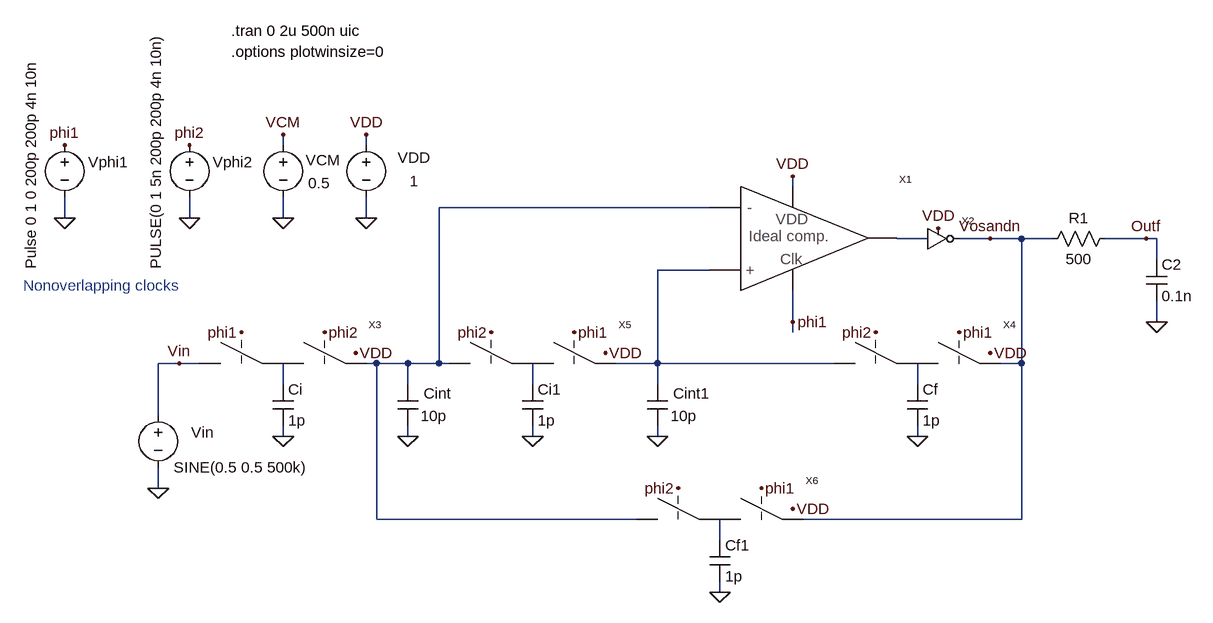
[diagram p0: schematic _Fig6_21_2nd_MSD.asc]
_Fig6_21_2nd_MSD.asc, the LTspice schematic file:
Version 4
SHEET 1 1008 680
WIRE -400 -176 -400 -192
WIRE -272 -176 -272 -192
WIRE 384 -112 384 -128
WIRE 256 -80 -160 -80
WIRE -736 -64 -736 -96
WIRE -544 -64 -544 -96
WIRE -400 -64 -400 -96
WIRE -272 -64 -272 -96
WIRE 592 -32 544 -32
WIRE 688 -32 640 -32
WIRE 736 -32 688 -32
WIRE 784 -32 736 -32
WIRE 928 -32 864 -32
WIRE 944 -32 928 -32
WIRE 944 0 944 -32
WIRE 256 16 176 16
WIRE 384 96 384 48
WIRE 944 96 944 64
WIRE 384 112 384 96
WIRE -560 160 -592 160
WIRE -528 160 -560 160
WIRE -256 160 -272 160
WIRE -208 160 -256 160
WIRE -160 160 -160 -80
WIRE -160 160 -208 160
WIRE -144 160 -160 160
WIRE 176 160 176 16
WIRE 176 160 112 160
WIRE 448 160 176 160
WIRE 736 160 736 -32
WIRE 736 160 704 160
WIRE -400 192 -400 160
WIRE -208 192 -208 160
WIRE -16 192 -16 160
WIRE 176 192 176 160
WIRE 576 192 576 160
WIRE -592 240 -592 160
WIRE -400 272 -400 256
WIRE -208 272 -208 256
WIRE -16 272 -16 256
WIRE 176 272 176 256
WIRE 576 272 576 256
WIRE -592 352 -592 320
WIRE -256 400 -256 160
WIRE 144 400 -256 400
WIRE 736 400 736 160
WIRE 736 400 400 400
WIRE 272 432 272 400
WIRE 272 512 272 496
FLAG -272 -64 0
FLAG 384 -128 VDD
FLAG -272 -192 VDD
FLAG -400 -64 0
FLAG -400 -192 VCM
FLAG 688 -32 Vosandn
FLAG -208 272 0
FLAG -592 352 0
FLAG -560 160 Vin
FLAG 944 96 0
FLAG 928 -32 Outf
FLAG 608 -48 VDD
FLAG 576 272 0
FLAG -400 272 0
FLAG 688 144 VDD
FLAG -288 144 VDD
FLAG -736 -64 0
FLAG -736 -176 phi1
FLAG -544 -64 0
FLAG -544 -176 phi2
FLAG -464 112 phi1
FLAG 640 112 phi1
FLAG 512 112 phi2
FLAG -336 112 phi2
FLAG 384 96 phi1
FLAG 176 272 0
FLAG -16 272 0
FLAG 96 144 VDD
FLAG -80 112 phi2
FLAG 48 112 phi1
FLAG 272 512 0
FLAG 384 384 VDD
FLAG 336 352 phi1
FLAG 208 352 phi2
SYMBOL Ideal_clocked_comparator 304 -32 R0
SYMATTR InstName X1
SYMBOL voltage -272 -192 R0
WINDOW 0 48 35 Left 0
WINDOW 3 67 71 Left 0
SYMATTR InstName VDD
SYMATTR Value 1
SYMBOL voltage -400 -192 R0
WINDOW 0 35 39 Left 0
WINDOW 3 39 74 Left 0
SYMATTR InstName VCM
SYMATTR Value 0.5
SYMBOL cap -224 192 R0
WINDOW 0 40 14 Left 0
WINDOW 3 36 49 Left 0
SYMATTR InstName Cint
SYMATTR Value 10p
SYMBOL voltage -592 224 R0
WINDOW 0 51 42 Left 0
WINDOW 123 0 0 Left 0
WINDOW 39 0 0 Left 0
SYMATTR InstName Vin
SYMATTR Value SINE(0.5 0.5 500k)
SYMBOL res 880 -48 R90
WINDOW 0 0 56 VBottom 0
WINDOW 3 32 56 VTop 0
SYMATTR InstName R1
SYMATTR Value 500
SYMBOL cap 928 0 R0
SYMATTR InstName C2
SYMATTR Value 0.1n
SYMBOL inverter 592 -32 R0
SYMATTR InstName X2
SYMBOL switches_2 -528 176 R0
SYMATTR InstName X3
SYMBOL switches_2 448 176 R0
SYMATTR InstName X4
SYMBOL cap -416 192 R0
SYMATTR InstName Ci
SYMATTR Value 1p
SYMBOL cap 560 192 R0
SYMATTR InstName Cf
SYMATTR Value 1p
SYMBOL voltage -736 -192 R0
WINDOW 0 36 42 Left 0
WINDOW 3 -52 207 VLeft 0
WINDOW 123 0 0 Left 0
WINDOW 39 0 0 Left 0
SYMATTR InstName Vphi1
SYMATTR Value Pulse 0 1 0 200p 200p 4n 10n
SYMBOL voltage -544 -192 R0
WINDOW 0 36 42 Left 0
WINDOW 3 -52 207 VLeft 0
WINDOW 123 0 0 Left 0
WINDOW 39 0 0 Left 0
SYMATTR InstName Vphi2
SYMATTR Value PULSE(0 1 5n 200p 200p 4n 10n)
SYMBOL cap 160 192 R0
WINDOW 0 40 14 Left 0
WINDOW 3 36 49 Left 0
SYMATTR InstName Cint1
SYMATTR Value 10p
SYMBOL switches_2 -144 176 R0
SYMATTR InstName X5
SYMBOL cap -32 192 R0
SYMATTR InstName Ci1
SYMATTR Value 1p
SYMBOL switches_2 144 416 R0
SYMATTR InstName X6
SYMBOL cap 256 432 R0
SYMATTR InstName Cf1
SYMATTR Value 1p
TEXT -480 -352 Left 0 !.tran 0 2u 500n uic
TEXT -480 -320 Left 0 !.options plotwinsize=0
TEXT -800 40 Left 0 ;Nonoverlapping clocks

The netlist it stands for:
* _Fig6_21_2nd_MSD.asc
XX1 N001 N003 N002 VDD phi1 Ideal_clocked_comparator  ; pins Vinm Vinp Vout VDD Clock
VDD VDD 0 1
VCM VCM 0 0.5
Cint N001 0 10p
Vin Vin 0 SINE(0.5 0.5 500k)
R1 Outf Vosandn 500
C2 Outf 0 0.1n
XX2 N002 Vosandn VDD inverter  ; pins In Out VDD
XX3 Vin phi1 phi2 N001 VDD N004 switches_2  ; pins P1 clk1 Clk2 P3 VDD P2
XX4 N003 phi2 phi1 Vosandn VDD N006 switches_2  ; pins P1 clk1 Clk2 P3 VDD P2
Ci N004 0 1p
Cf N006 0 1p
Vphi1 phi1 0 Pulse 0 1 0 200p 200p 4n 10n
Vphi2 phi2 0 PULSE(0 1 5n 200p 200p 4n 10n)
Cint1 N003 0 10p
XX5 N001 phi2 phi1 N003 VDD N005 switches_2  ; pins P1 clk1 Clk2 P3 VDD P2
Ci1 N005 0 1p
XX6 N001 phi2 phi1 Vosandn VDD N007 switches_2  ; pins P1 clk1 Clk2 P3 VDD P2
Cf1 N007 0 1p
.tran 0 2u 500n uic
.options plotwinsize=0
* Nonoverlapping clocks
.backanno
.end